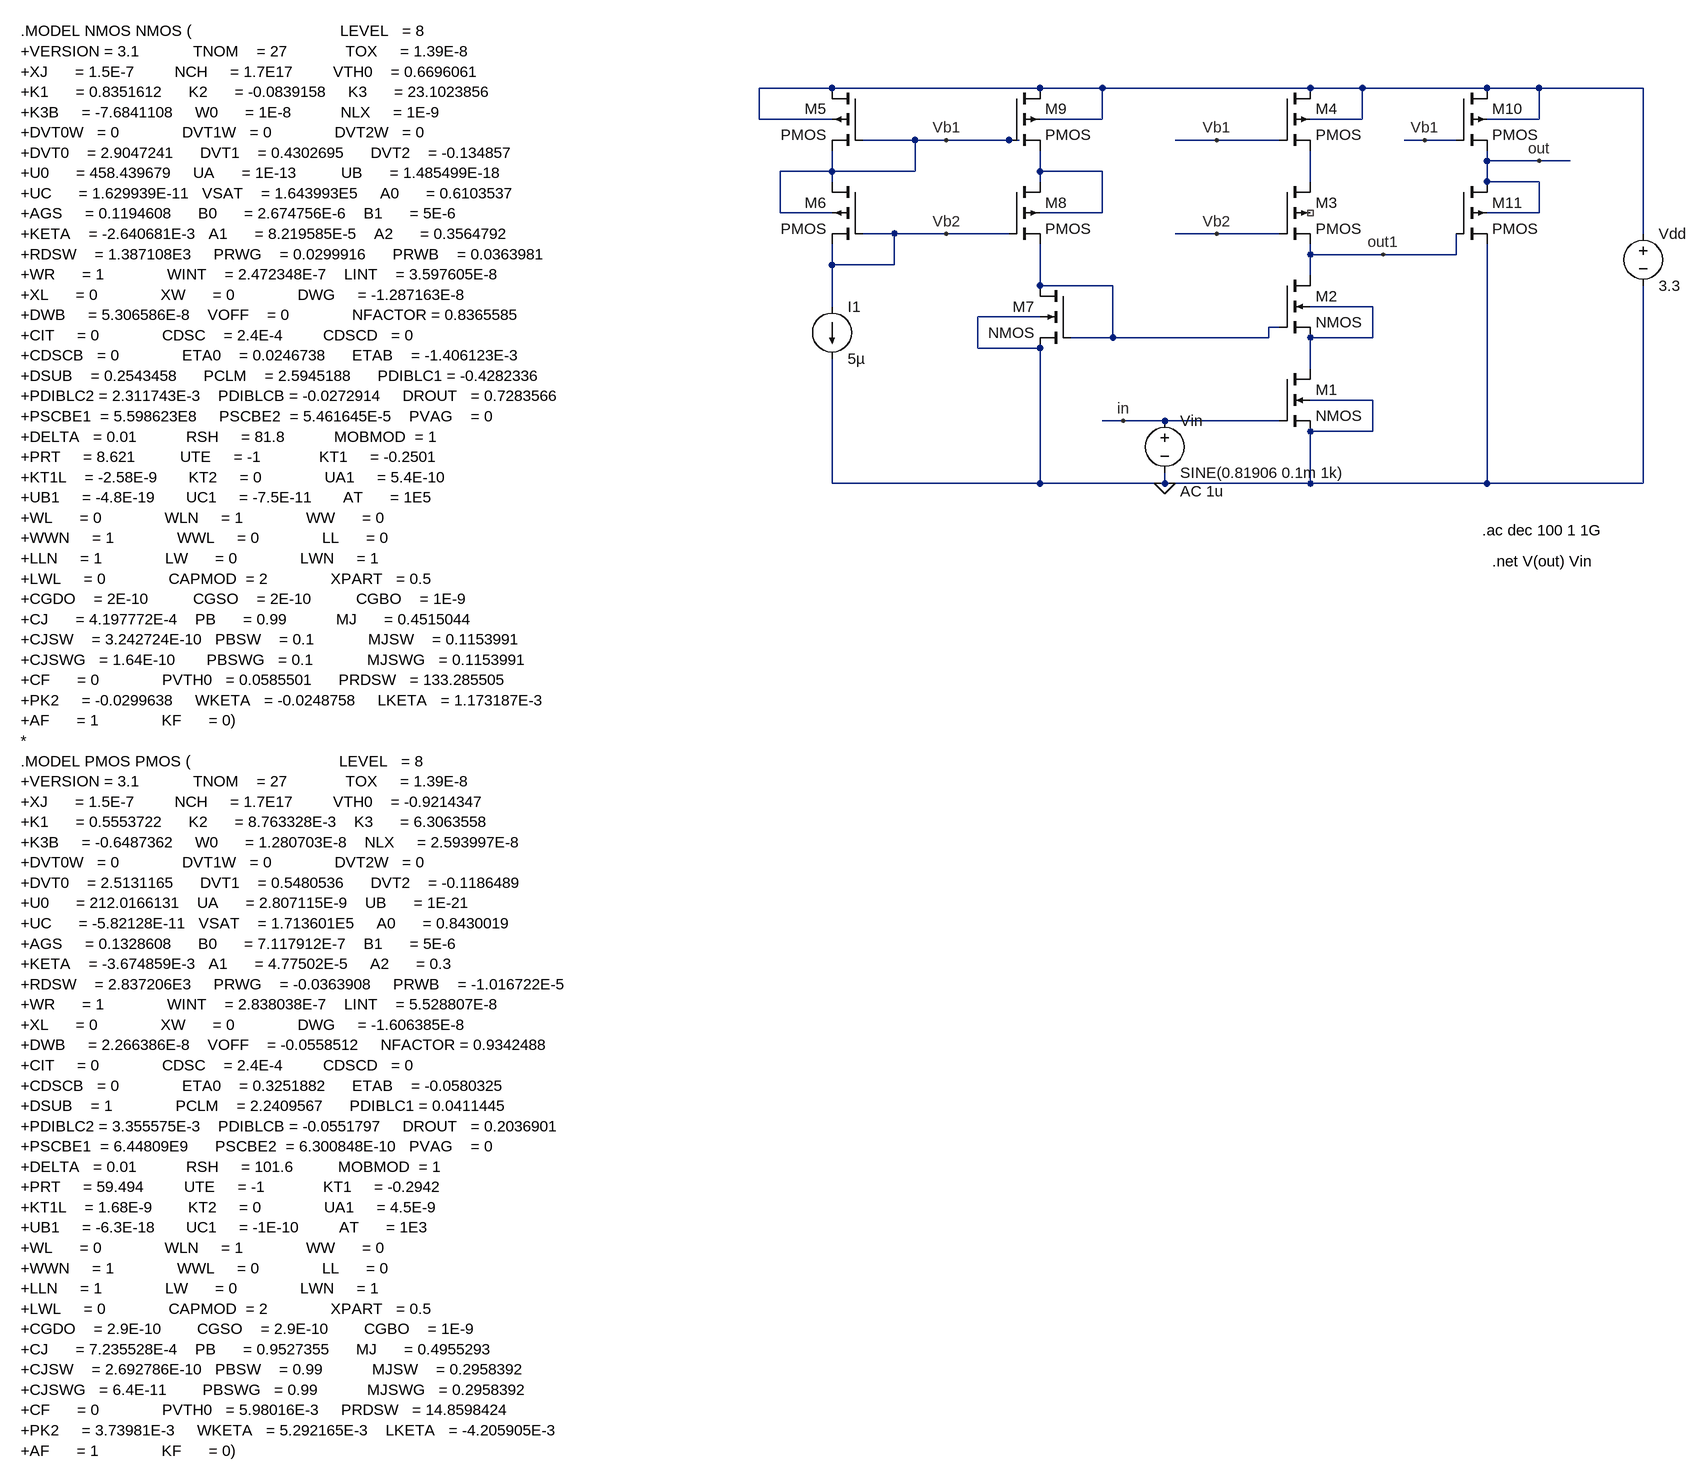
[diagram p0: schematic Draft2.asc]
Draft2.asc, the LTspice schematic file:
Version 4
SHEET 1 880 1456
WIRE -480 -432 -592 -432
WIRE -160 -432 -480 -432
WIRE -64 -432 -160 -432
WIRE 256 -432 -64 -432
WIRE 336 -432 256 -432
WIRE 528 -432 336 -432
WIRE 608 -432 528 -432
WIRE 768 -432 608 -432
WIRE -592 -384 -592 -432
WIRE -480 -384 -592 -384
WIRE -64 -384 -64 -432
WIRE -64 -384 -160 -384
WIRE 336 -384 336 -432
WIRE 336 -384 256 -384
WIRE 608 -384 608 -432
WIRE 608 -384 528 -384
WIRE -352 -352 -432 -352
WIRE -304 -352 -352 -352
WIRE -208 -352 -304 -352
WIRE -192 -352 -208 -352
WIRE 112 -352 48 -352
WIRE 208 -352 112 -352
WIRE 432 -352 400 -352
WIRE 480 -352 432 -352
WIRE 528 -320 528 -336
WIRE 608 -320 528 -320
WIRE 656 -320 608 -320
WIRE -480 -304 -480 -336
WIRE -480 -304 -560 -304
WIRE -352 -304 -352 -352
WIRE -352 -304 -480 -304
WIRE -160 -304 -160 -336
WIRE -64 -304 -160 -304
WIRE -480 -288 -480 -304
WIRE -160 -288 -160 -304
WIRE 256 -288 256 -336
WIRE 528 -288 528 -320
WIRE 608 -288 528 -288
WIRE -560 -240 -560 -304
WIRE -480 -240 -560 -240
WIRE -64 -240 -64 -304
WIRE -64 -240 -160 -240
WIRE 608 -240 608 -288
WIRE 608 -240 528 -240
WIRE -384 -208 -432 -208
WIRE -304 -208 -384 -208
WIRE -208 -208 -304 -208
WIRE 112 -208 48 -208
WIRE 208 -208 112 -208
WIRE 768 -208 768 -432
WIRE 256 -176 256 -192
WIRE 368 -176 256 -176
WIRE 480 -176 480 -208
WIRE 480 -176 368 -176
WIRE -480 -160 -480 -192
WIRE -384 -160 -384 -208
WIRE -384 -160 -480 -160
WIRE 256 -144 256 -176
WIRE -160 -128 -160 -192
WIRE -48 -128 -160 -128
WIRE -160 -112 -160 -128
WIRE -480 -96 -480 -160
WIRE 352 -96 256 -96
WIRE -160 -80 -256 -80
WIRE 208 -64 192 -64
WIRE -48 -48 -48 -128
WIRE -48 -48 -112 -48
WIRE 192 -48 192 -64
WIRE 192 -48 -48 -48
WIRE 352 -48 352 -96
WIRE 352 -48 256 -48
WIRE -256 -32 -256 -80
WIRE -160 -32 -256 -32
WIRE 256 0 256 -48
WIRE 352 48 256 48
WIRE -32 80 -64 80
WIRE 32 80 -32 80
WIRE 208 80 32 80
WIRE 352 96 352 48
WIRE 352 96 256 96
WIRE -480 176 -480 -16
WIRE -160 176 -160 -32
WIRE -160 176 -480 176
WIRE 32 176 32 160
WIRE 32 176 -160 176
WIRE 256 176 256 96
WIRE 256 176 32 176
WIRE 528 176 528 -192
WIRE 528 176 256 176
WIRE 768 176 768 -128
WIRE 768 176 528 176
FLAG 112 -352 Vb1
FLAG -304 -352 Vb1
FLAG 112 -208 Vb2
FLAG -304 -208 Vb2
FLAG -32 80 in
FLAG 368 -176 out1
FLAG 608 -320 out
FLAG 432 -352 Vb1
FLAG 32 176 0
SYMBOL nmos4 208 0 R0
SYMATTR InstName M1
SYMATTR Value2 l=1u w=510.13u
SYMBOL nmos4 208 -144 R0
SYMATTR InstName M2
SYMATTR Value2 l=1u w=510.13u
SYMBOL pmos4 208 -288 R0
SYMATTR InstName M3
SYMATTR Value2 l=1u w=1015.3u
SYMBOL pmos4 208 -432 R0
SYMATTR InstName M4
SYMATTR Value2 l=1u w=1015.3u
SYMBOL pmos4 -432 -432 M0
SYMATTR InstName M5
SYMATTR Value2 l=1u w=1015.3u
SYMBOL pmos4 -432 -288 M0
SYMATTR InstName M6
SYMATTR Value2 l=1u w=1015.3u
SYMBOL nmos4 -112 -128 M0
SYMATTR InstName M7
SYMATTR Value2 l=1u w=510.13u
SYMBOL pmos4 -208 -288 R0
SYMATTR InstName M8
SYMATTR Value2 l=1u w=1015.3u
SYMBOL pmos4 -208 -432 R0
SYMATTR InstName M9
SYMATTR Value2 l=1u w=1015.3u
SYMBOL pmos4 480 -432 R0
SYMATTR InstName M10
SYMATTR Value2 l=1u w=1015.3u
SYMBOL pmos4 480 -288 R0
SYMATTR InstName M11
SYMATTR Value2 l=1u w=1015.3u
SYMBOL voltage 768 -224 R0
WINDOW 123 0 0 Left 0
WINDOW 39 0 0 Left 0
SYMATTR InstName Vdd
SYMATTR Value 3.3
SYMBOL current -480 -96 R0
WINDOW 123 0 0 Left 0
WINDOW 39 0 0 Left 0
SYMATTR InstName I1
SYMATTR Value 5µ
SYMBOL voltage 32 64 R0
WINDOW 123 24 124 Left 2
WINDOW 39 0 0 Left 0
SYMATTR InstName Vin
SYMATTR Value SINE(0.81906 0.1m 1k)
SYMATTR Value2 AC 1u
TEXT 520 248 Left 2 !.ac dec 100 1 1G
TEXT 536 296 Left 2 !.net V(out) Vin
TEXT -1728 -520 Left 2 !.MODEL NMOS NMOS (                                 LEVEL   = 8\n+VERSION = 3.1            TNOM    = 27             TOX     = 1.39E-8\n+XJ      = 1.5E-7         NCH     = 1.7E17         VTH0    = 0.6696061\n+K1      = 0.8351612      K2      = -0.0839158     K3      = 23.1023856\n+K3B     = -7.6841108     W0      = 1E-8           NLX     = 1E-9\n+DVT0W   = 0              DVT1W   = 0              DVT2W   = 0\n+DVT0    = 2.9047241      DVT1    = 0.4302695      DVT2    = -0.134857\n+U0      = 458.439679     UA      = 1E-13          UB      = 1.485499E-18\n+UC      = 1.629939E-11   VSAT    = 1.643993E5     A0      = 0.6103537\n+AGS     = 0.1194608      B0      = 2.674756E-6    B1      = 5E-6\n+KETA    = -2.640681E-3   A1      = 8.219585E-5    A2      = 0.3564792\n+RDSW    = 1.387108E3     PRWG    = 0.0299916      PRWB    = 0.0363981\n+WR      = 1              WINT    = 2.472348E-7    LINT    = 3.597605E-8\n+XL      = 0              XW      = 0              DWG     = -1.287163E-8\n+DWB     = 5.306586E-8    VOFF    = 0              NFACTOR = 0.8365585\n+CIT     = 0              CDSC    = 2.4E-4         CDSCD   = 0\n+CDSCB   = 0              ETA0    = 0.0246738      ETAB    = -1.406123E-3\n+DSUB    = 0.2543458      PCLM    = 2.5945188      PDIBLC1 = -0.4282336\n+PDIBLC2 = 2.311743E-3    PDIBLCB = -0.0272914     DROUT   = 0.7283566\n+PSCBE1  = 5.598623E8     PSCBE2  = 5.461645E-5    PVAG    = 0\n+DELTA   = 0.01           RSH     = 81.8           MOBMOD  = 1\n+PRT     = 8.621          UTE     = -1             KT1     = -0.2501\n+KT1L    = -2.58E-9       KT2     = 0              UA1     = 5.4E-10\n+UB1     = -4.8E-19       UC1     = -7.5E-11       AT      = 1E5\n+WL      = 0              WLN     = 1              WW      = 0\n+WWN     = 1              WWL     = 0              LL      = 0\n+LLN     = 1              LW      = 0              LWN     = 1\n+LWL     = 0              CAPMOD  = 2              XPART   = 0.5\n+CGDO    = 2E-10          CGSO    = 2E-10          CGBO    = 1E-9\n+CJ      = 4.197772E-4    PB      = 0.99           MJ      = 0.4515044\n+CJSW    = 3.242724E-10   PBSW    = 0.1            MJSW    = 0.1153991\n+CJSWG   = 1.64E-10       PBSWG   = 0.1            MJSWG   = 0.1153991\n+CF      = 0              PVTH0   = 0.0585501      PRDSW   = 133.285505\n+PK2     = -0.0299638     WKETA   = -0.0248758     LKETA   = 1.173187E-3\n+AF      = 1              KF      = 0)\n*\n.MODEL PMOS PMOS (                                 LEVEL   = 8\n+VERSION = 3.1            TNOM    = 27             TOX     = 1.39E-8\n+XJ      = 1.5E-7         NCH     = 1.7E17         VTH0    = -0.9214347\n+K1      = 0.5553722      K2      = 8.763328E-3    K3      = 6.3063558\n+K3B     = -0.6487362     W0      = 1.280703E-8    NLX     = 2.593997E-8\n+DVT0W   = 0              DVT1W   = 0              DVT2W   = 0\n+DVT0    = 2.5131165      DVT1    = 0.5480536      DVT2    = -0.1186489\n+U0      = 212.0166131    UA      = 2.807115E-9    UB      = 1E-21\n+UC      = -5.82128E-11   VSAT    = 1.713601E5     A0      = 0.8430019\n+AGS     = 0.1328608      B0      = 7.117912E-7    B1      = 5E-6\n+KETA    = -3.674859E-3   A1      = 4.77502E-5     A2      = 0.3\n+RDSW    = 2.837206E3     PRWG    = -0.0363908     PRWB    = -1.016722E-5\n+WR      = 1              WINT    = 2.838038E-7    LINT    = 5.528807E-8\n+XL      = 0              XW      = 0              DWG     = -1.606385E-8\n+DWB     = 2.266386E-8    VOFF    = -0.0558512     NFACTOR = 0.9342488\n+CIT     = 0              CDSC    = 2.4E-4         CDSCD   = 0\n+CDSCB   = 0              ETA0    = 0.3251882      ETAB    = -0.0580325\n+DSUB    = 1              PCLM    = 2.2409567      PDIBLC1 = 0.0411445\n+PDIBLC2 = 3.355575E-3    PDIBLCB = -0.0551797     DROUT   = 0.2036901\n+PSCBE1  = 6.44809E9      PSCBE2  = 6.300848E-10   PVAG    = 0\n+DELTA   = 0.01           RSH     = 101.6          MOBMOD  = 1\n+PRT     = 59.494         UTE     = -1             KT1     = -0.2942\n+KT1L    = 1.68E-9        KT2     = 0              UA1     = 4.5E-9\n+UB1     = -6.3E-18       UC1     = -1E-10         AT      = 1E3\n+WL      = 0              WLN     = 1              WW      = 0\n+WWN     = 1              WWL     = 0              LL      = 0\n+LLN     = 1              LW      = 0              LWN     = 1\n+LWL     = 0              CAPMOD  = 2              XPART   = 0.5\n+CGDO    = 2.9E-10        CGSO    = 2.9E-10        CGBO    = 1E-9\n+CJ      = 7.235528E-4    PB      = 0.9527355      MJ      = 0.4955293\n+CJSW    = 2.692786E-10   PBSW    = 0.99           MJSW    = 0.2958392\n+CJSWG   = 6.4E-11        PBSWG   = 0.99           MJSWG   = 0.2958392\n+CF      = 0              PVTH0   = 5.98016E-3     PRDSW   = 14.8598424\n+PK2     = 3.73981E-3     WKETA   = 5.292165E-3    LKETA   = -4.205905E-3 \n+AF      = 1              KF      = 0)

The netlist it stands for:
* Draft2.asc
M1 N005 in 0 0 NMOS l=1u w=510.13u
M2 out1 N004 N005 N005 NMOS l=1u w=510.13u
M3 N003 Vb2 out1 NC_01 PMOS l=1u w=1015.3u
M4 N001 Vb1 N003 N001 PMOS l=1u w=1015.3u
M5 N001 Vb1 Vb1 N001 PMOS l=1u w=1015.3u
M6 Vb1 Vb2 Vb2 Vb1 PMOS l=1u w=1015.3u
M7 N004 N004 0 0 NMOS l=1u w=510.13u
M8 N002 Vb2 N004 N002 PMOS l=1u w=1015.3u
M9 N001 Vb1 N002 N001 PMOS l=1u w=1015.3u
M10 N001 Vb1 out N001 PMOS l=1u w=1015.3u
M11 out out1 0 out PMOS l=1u w=1015.3u
Vdd N001 0 3.3
I1 Vb2 0 5µ
Vin in 0 SINE(0.81906 0.1m 1k) AC 1u
.model NMOS NMOS
.model PMOS PMOS
.lib standard.mos
.ac dec 100 1 1G
.net V(out) Vin
.MODEL NMOS NMOS (                                 LEVEL   = 8
+VERSION = 3.1            TNOM    = 27             TOX     = 1.39E-8
+XJ      = 1.5E-7         NCH     = 1.7E17         VTH0    = 0.6696061
+K1      = 0.8351612      K2      = -0.0839158     K3      = 23.1023856
+K3B     = -7.6841108     W0      = 1E-8           NLX     = 1E-9
+DVT0W   = 0              DVT1W   = 0              DVT2W   = 0
+DVT0    = 2.9047241      DVT1    = 0.4302695      DVT2    = -0.134857
+U0      = 458.439679     UA      = 1E-13          UB      = 1.485499E-18
+UC      = 1.629939E-11   VSAT    = 1.643993E5     A0      = 0.6103537
+AGS     = 0.1194608      B0      = 2.674756E-6    B1      = 5E-6
+KETA    = -2.640681E-3   A1      = 8.219585E-5    A2      = 0.3564792
+RDSW    = 1.387108E3     PRWG    = 0.0299916      PRWB    = 0.0363981
+WR      = 1              WINT    = 2.472348E-7    LINT    = 3.597605E-8
+XL      = 0              XW      = 0              DWG     = -1.287163E-8
+DWB     = 5.306586E-8    VOFF    = 0              NFACTOR = 0.8365585
+CIT     = 0              CDSC    = 2.4E-4         CDSCD   = 0
+CDSCB   = 0              ETA0    = 0.0246738      ETAB    = -1.406123E-3
+DSUB    = 0.2543458      PCLM    = 2.5945188      PDIBLC1 = -0.4282336
+PDIBLC2 = 2.311743E-3    PDIBLCB = -0.0272914     DROUT   = 0.7283566
+PSCBE1  = 5.598623E8     PSCBE2  = 5.461645E-5    PVAG    = 0
+DELTA   = 0.01           RSH     = 81.8           MOBMOD  = 1
+PRT     = 8.621          UTE     = -1             KT1     = -0.2501
+KT1L    = -2.58E-9       KT2     = 0              UA1     = 5.4E-10
+UB1     = -4.8E-19       UC1     = -7.5E-11       AT      = 1E5
+WL      = 0              WLN     = 1              WW      = 0
+WWN     = 1              WWL     = 0              LL      = 0
+LLN     = 1              LW      = 0              LWN     = 1
+LWL     = 0              CAPMOD  = 2              XPART   = 0.5
+CGDO    = 2E-10          CGSO    = 2E-10          CGBO    = 1E-9
+CJ      = 4.197772E-4    PB      = 0.99           MJ      = 0.4515044
+CJSW    = 3.242724E-10   PBSW    = 0.1            MJSW    = 0.1153991
+CJSWG   = 1.64E-10       PBSWG   = 0.1            MJSWG   = 0.1153991
+CF      = 0              PVTH0   = 0.0585501      PRDSW   = 133.285505
+PK2     = -0.0299638     WKETA   = -0.0248758     LKETA   = 1.173187E-3
+AF      = 1              KF      = 0)
*
.MODEL PMOS PMOS (                                 LEVEL   = 8
+VERSION = 3.1            TNOM    = 27             TOX     = 1.39E-8
+XJ      = 1.5E-7         NCH     = 1.7E17         VTH0    = -0.9214347
+K1      = 0.5553722      K2      = 8.763328E-3    K3      = 6.3063558
+K3B     = -0.6487362     W0      = 1.280703E-8    NLX     = 2.593997E-8
+DVT0W   = 0              DVT1W   = 0              DVT2W   = 0
+DVT0    = 2.5131165      DVT1    = 0.5480536      DVT2    = -0.1186489
+U0      = 212.0166131    UA      = 2.807115E-9    UB      = 1E-21
+UC      = -5.82128E-11   VSAT    = 1.713601E5     A0      = 0.8430019
+AGS     = 0.1328608      B0      = 7.117912E-7    B1      = 5E-6
+KETA    = -3.674859E-3   A1      = 4.77502E-5     A2      = 0.3
+RDSW    = 2.837206E3     PRWG    = -0.0363908     PRWB    = -1.016722E-5
+WR      = 1              WINT    = 2.838038E-7    LINT    = 5.528807E-8
+XL      = 0              XW      = 0              DWG     = -1.606385E-8
+DWB     = 2.266386E-8    VOFF    = -0.0558512     NFACTOR = 0.9342488
+CIT     = 0              CDSC    = 2.4E-4         CDSCD   = 0
+CDSCB   = 0              ETA0    = 0.3251882      ETAB    = -0.0580325
+DSUB    = 1              PCLM    = 2.2409567      PDIBLC1 = 0.0411445
+PDIBLC2 = 3.355575E-3    PDIBLCB = -0.0551797     DROUT   = 0.2036901
+PSCBE1  = 6.44809E9      PSCBE2  = 6.300848E-10   PVAG    = 0
+DELTA   = 0.01           RSH     = 101.6          MOBMOD  = 1
+PRT     = 59.494         UTE     = -1             KT1     = -0.2942
+KT1L    = 1.68E-9        KT2     = 0              UA1     = 4.5E-9
+UB1     = -6.3E-18       UC1     = -1E-10         AT      = 1E3
+WL      = 0              WLN     = 1              WW      = 0
+WWN     = 1              WWL     = 0              LL      = 0
+LLN     = 1              LW      = 0              LWN     = 1
+LWL     = 0              CAPMOD  = 2              XPART   = 0.5
+CGDO    = 2.9E-10        CGSO    = 2.9E-10        CGBO    = 1E-9
+CJ      = 7.235528E-4    PB      = 0.9527355      MJ      = 0.4955293
+CJSW    = 2.692786E-10   PBSW    = 0.99           MJSW    = 0.2958392
+CJSWG   = 6.4E-11        PBSWG   = 0.99           MJSWG   = 0.2958392
+CF      = 0              PVTH0   = 5.98016E-3     PRDSW   = 14.8598424
+PK2     = 3.73981E-3     WKETA   = 5.292165E-3    LKETA   = -4.205905E-3
+AF      = 1              KF      = 0)
.backanno
.end